# Altium project coursework.PrjPcb
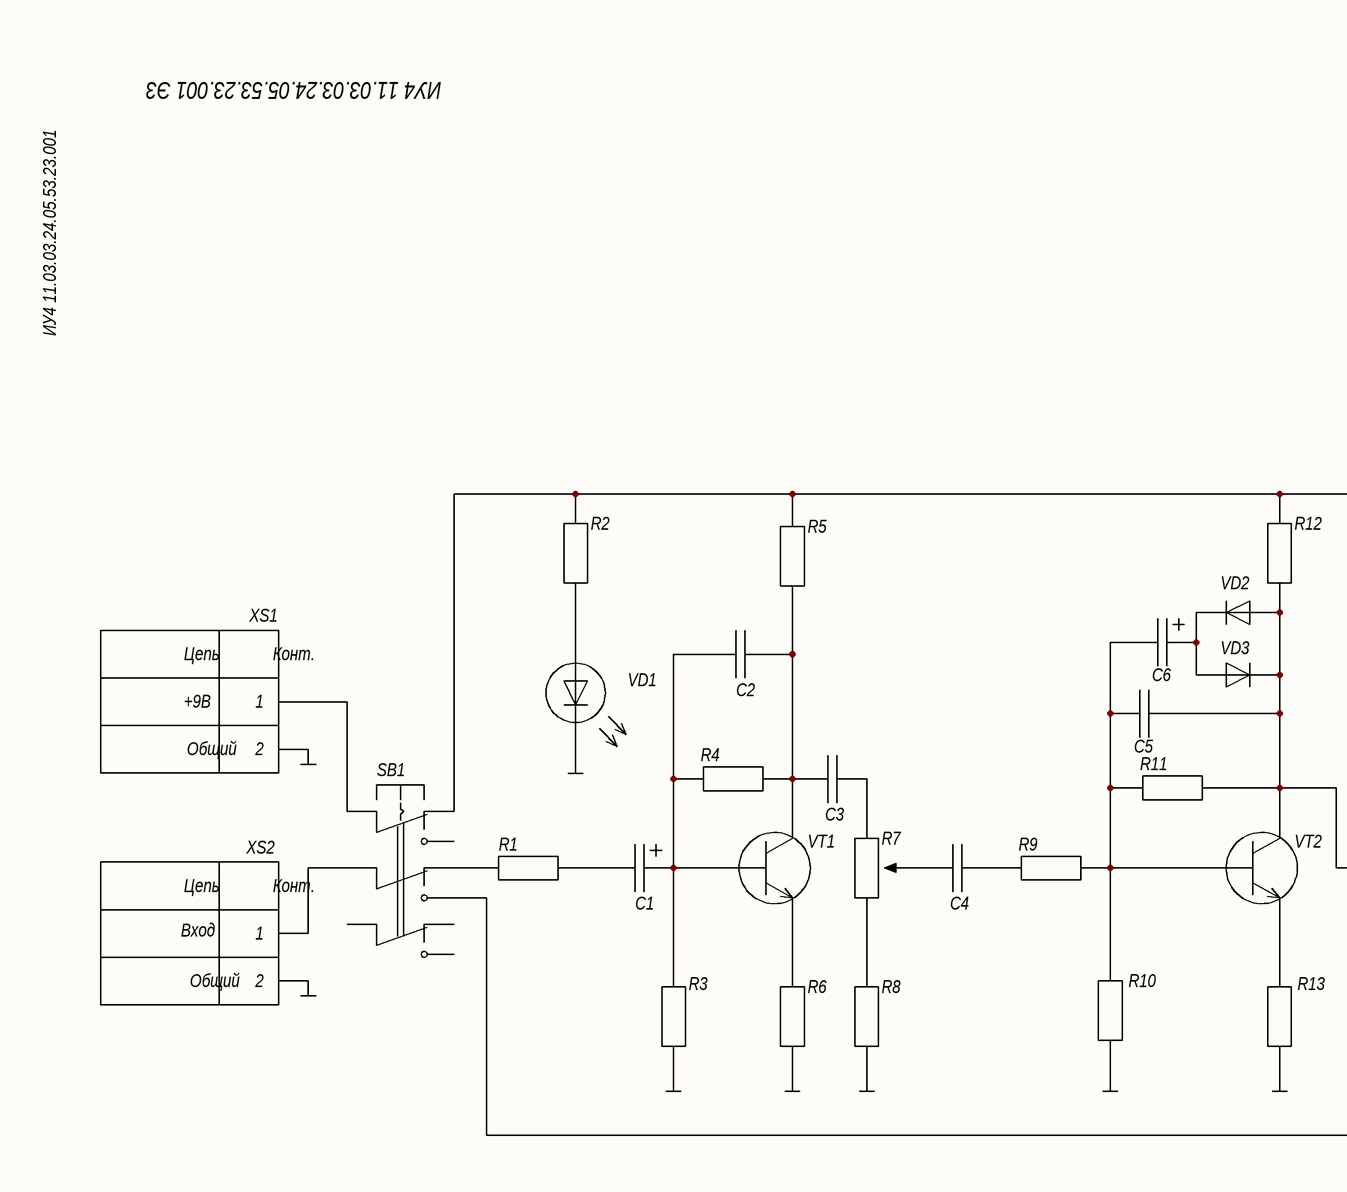
[diagram p0: schema.SchDoc, left]
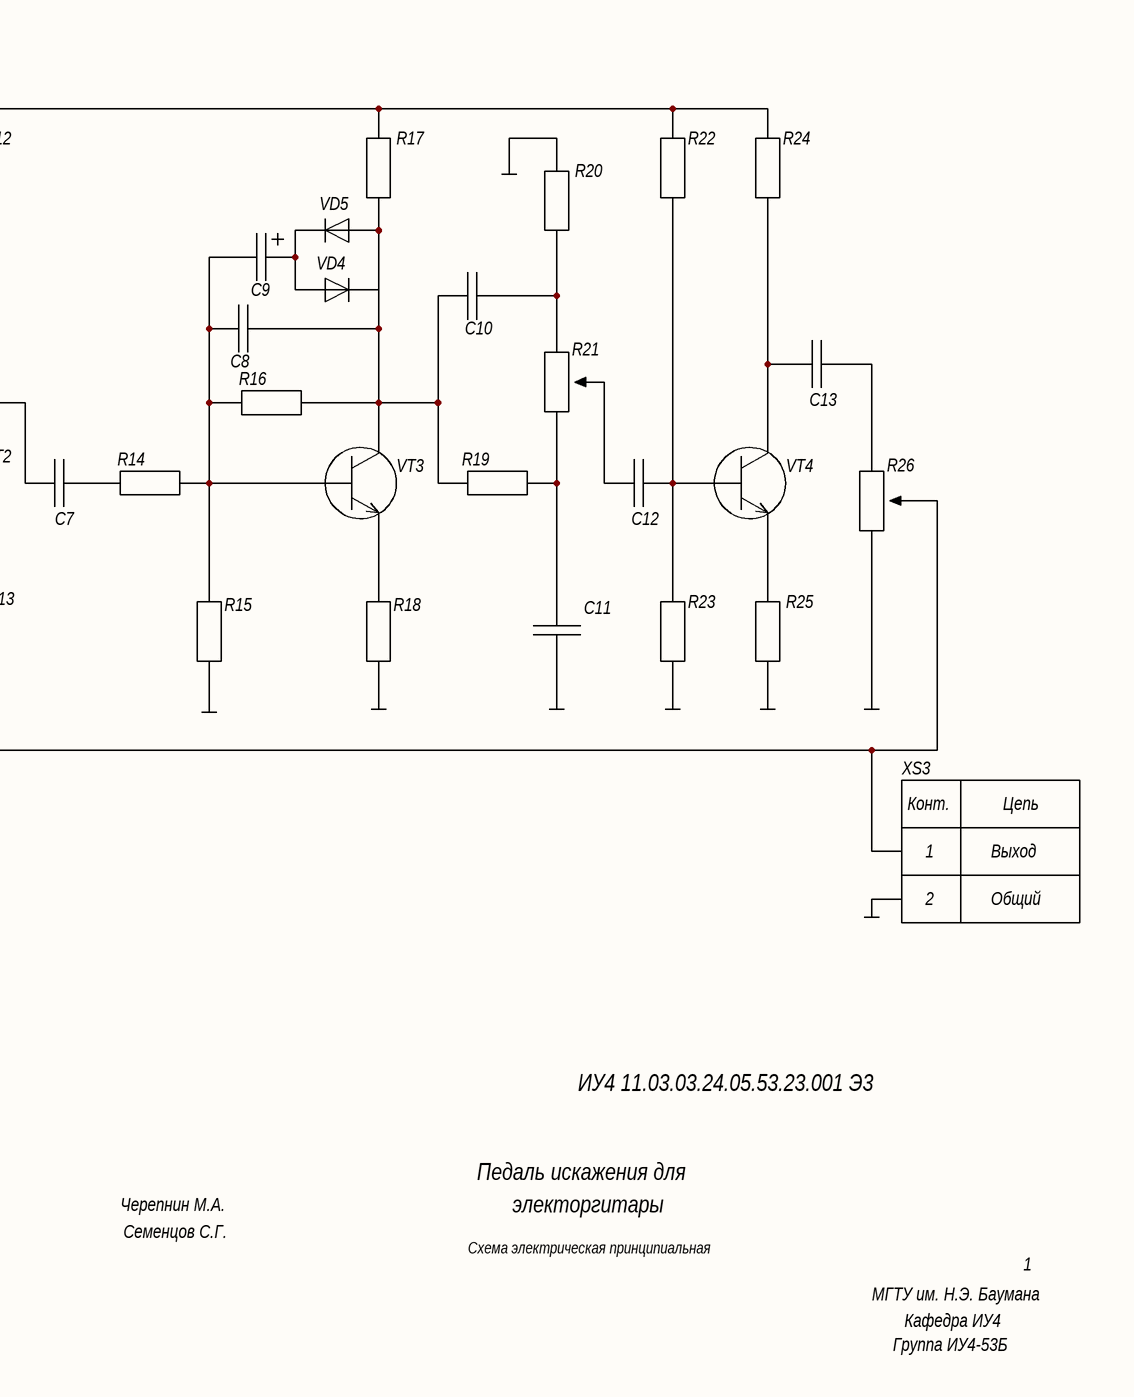
[diagram p1: schema.SchDoc, right]
Папка для сохранения графической документации: Документация; Папка для сохранения текстовой документации: Документация
1 sheet, 52 parts. Net scope: global (net labels, ports and power ports of the same name join across sheets).
Board file: board.PcbDoc

## Sheet schema.SchDoc: Наименование
size 420 x 297 mm; ApprovedBy: Утвердил; CheckedBy: Проверил; Author: Разработал; CompanyName: Организация; DrawnBy: Н.Контр; Engineer: Т.Контр; SheetNumber: 1; SheetTotal: 1; PageSetup: Record=PageOptions|CenterHorizontal=True|CenterVertical=True|PrintScale=0.94|XCorrection=1.00|YCorrection=1.00|PrintKind=1|BorderSize=5000000|LeftOffset=0|BottomOffset=0|Orientation=1|PaperLength=1000|PaperWidth=1000|Scale=100|PaperSource=7|PrintQuality=-4|MediaType=1|DitherType=10|PaperKind=A4|PrintScaleMode=1; DecimalNumber: Децимальный номер; HeadOfSector: Нач. сектора; MainDevice: Перв.примен.; Name: Наименование; DocumentName: Sheet1.SCHDOC

### Parts
C1  1 мкФ  [CE]  (value not drawn)
C2  470 пФ  [СC]  (value not drawn)
C3  1 мкФ  [СC]  (value not drawn)
C4  100 нФ  [СC]  (value not drawn)
C5  470 пФ  [СC]  (value not drawn)
C6  1 мкФ  [CE]  (value not drawn)
C7  100 нФ  [СC]  (value not drawn)
C8  470 пФ  [СC]  (value not drawn)
C9  1 мкФ  [CE]  (value not drawn)
C10  4 нФ  [СC]  (value not drawn)
C11  10 нФ  [СC]  (value not drawn)
C12  100 нФ  [СC]  (value not drawn)
C13  100 нФ  [СC]  (value not drawn)
R1  39 кОм  [R]  (value not drawn)
R2  390 Ом  [R]  (value not drawn)
R3  47 кОм  [R]  (value not drawn)
R4  470 кОм  [R]  (value not drawn)
R5  10 кОм  [R]  (value not drawn)
R6  100 Ом  [R]  (value not drawn)
R7  100 кОм  [RP]  (value not drawn)
R8  1 кОм  [R]  (value not drawn)
R9  10 кОм  [R]  (value not drawn)
R10  100 кОм  [R]  (value not drawn)
R11  470 кОм  [R]  (value not drawn)
R12  10 кОм  [R]  (value not drawn)
R13  150 Ом  [R]  (value not drawn)
R14  10 кОм  [R]  (value not drawn)
R15  100 кОм  [R]  (value not drawn)
R16  470 кОм  [R]  (value not drawn)
R17  10 кОм  [R]  (value not drawn)
R18  150 Ом  [R]  (value not drawn)
R19  39 кОм  [R]  (value not drawn)
R20  22 кОм  [R]  (value not drawn)
R21  100 кОм  [RP]  (value not drawn)
R22  430 кОм  [R]  (value not drawn)
R23  100 кОм  [R]  (value not drawn)
R24  15 кОм  [R]  (value not drawn)
R25  3,3 кОм  [R]  (value not drawn)
R26  100 кОм  [RP]  (value not drawn)
SB1  3PDT  [3PDT]  (value not drawn)
VD1  Led  [LED]  (value not drawn)
VD2  Diode  [D]  (value not drawn)
VD3  Diode  [D]  (value not drawn)
VD4  Diode  [D]  (value not drawn)
VD5  Diode  [D]  (value not drawn)
VT1  Transistor  [BC239C]  (value not drawn)
VT2  Transistor  [BC239C]  (value not drawn)
VT3  Transistor  [BC239C]  (value not drawn)
VT4  Transistor  [BC239C]  (value not drawn)
XS1  Connector +9V  [CON]  (value not drawn)
XS2  Connector Jack IN  [TRS_6.3mm]  (value not drawn)
XS3  Connector Jack OUT  [TRS_6.3mm]  (value not drawn)

### Nets
GND: C11.1 R3.1 R6.1 R8.1 R10.1 R13.1 R15.1 R18.1 R20.2 R23.1 R25.1 R26.1 VD1.1 XS1.1 XS2.2 XS3.2
NetC1_1: C1.1(N) R1.2
NetC1_2: C1.2(P) C2.1 R3.2 R4.1 VT1.2(Base)
NetC2_2: C2.2 C3.1 R4.2 R5.1 VT1.1(Collector)
NetC3_2: C3.2 R7.3
NetC4_1: C4.1 R7.2
NetC4_2: C4.2 R9.1
NetC5_1: C5.1 C6.1(N) R9.2 R10.2 R11.1 VT2.2(Base)
NetC5_2: C5.2 C7.1 R11.2 R12.1 VD2.2(A) VD3.1(K) VT2.1(Collector)
NetC6_2: C6.2(P) VD2.1(K) VD3.2(A)
NetC7_2: C7.2 R14.1
NetC8_1: C8.1 C9.1(N) R14.2 R15.2 R16.1 VT3.2(Base)
NetC8_2: C8.2 C10.1 R16.2 R17.1 R19.1 VD4.1(K) VD5.2(A) VT3.1(Collector)
NetC9_2: C9.2(P) VD4.2(A) VD5.1(K)
NetC10_2: C10.2 R20.1 R21.3
NetC11_2: C11.2 R19.2 R21.1
NetC12_1: C12.1 R22.1 R23.2 VT4.2(Base)
NetC12_2: C12.2 R21.2
NetC13_1: C13.1 R26.3
NetC13_2: C13.2 R24.1 VT4.1(Collector)
NetR1_1: R1.1 SB1.4
NetR2_1: R2.1 VD1.2
NetR2_2: R2.2 R5.2 R12.2 R17.2 R22.2 R24.2 SB1.1
NetR6_2: R6.2 VT1.3(Emitter)
NetR7_1: R7.1 R8.2
NetR13_2: R13.2 VT2.3(Emitter)
NetR18_2: R18.2 VT3.3(Emitter)
NetR25_2: R25.2 VT4.3(Emitter)
NetR26_2: R26.2 SB1.6 XS3.1
NetSB1_2: SB1.2 XS1.2
NetSB1_5: SB1.5 XS2.4

Not connected (* = marked no-connect by the designer): SB1 7 8 9 12

### Notes on the sheet
- ИУ4 11.03.03.24.05.53.23.001 Э3
- ИУ4 11.03.03.24.05.53.23.001
- Педаль искажения для
- Черепнин М.А.
- Семенцов С.Г.
- Схема электрическая принципиальная
- электоргитары
- 1
- МГТУ им. Н.Э. Баумана
- Группа ИУ4-53Б
- Кафедра ИУ4
- Перв.примен.
- Справ.№
- Подп. и дата
- Инв.№ дубл.
- Взам.инв.№
- Подп.и дата
- Разраб.
- Изм.
- Лист
- № докум.
- Подп.
- Дата
- Лит.
- Масштаб
- Масса
- Пров.
- Листов
- Инв.№ подл.
- (in symbol Connector +9V) Цепь; Конт.; +9В; Общий
- (in symbol Connector Jack IN) Цепь; Конт.; Вход; 1; Общий
- (in symbol Connector Jack OUT) Конт.; Цепь; Выход; Общий

### Library data of the parts
C1 C6 C9 = Capacitor Electrolytic
C2-C5 C7 C8 C10-C13 = Capacitor Ceramic
R1-R6 R8-R20 R22-R25 = Resistor
R7 R21 R26 = Potentiometer
VD1 = Led: RED